# EAGLE schematic lt mikro workshop buckup (EAGLE 7.6.0)

## Sheet 1 of 2
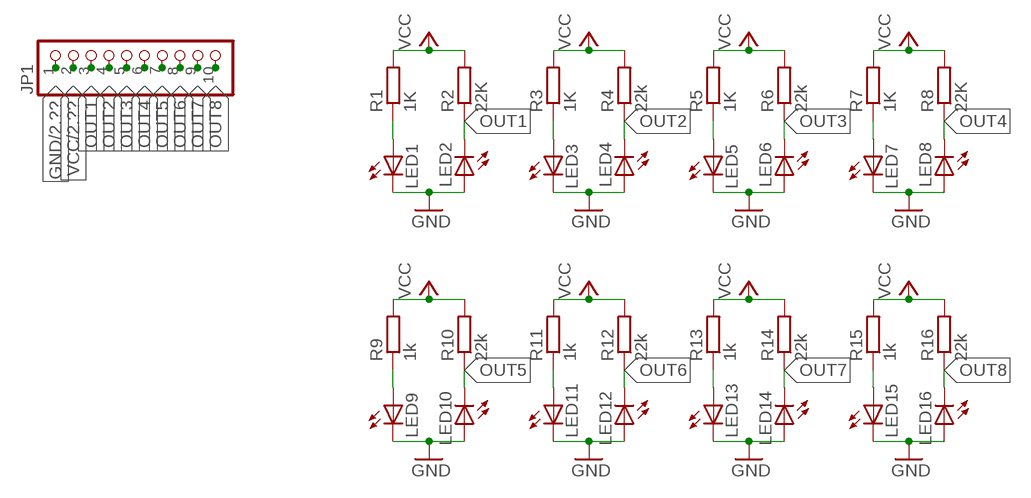
[diagram p0: schematic, sheet 1]

### Parts
JP1  PINHD-1X10  [1X10]
LED1  LED3MM  [LED3MM]
LED2  LED3MM  [LED3MM]
LED3  LED3MM  [LED3MM]
LED4  LED3MM  [LED3MM]
LED5  LED3MM  [LED3MM]
LED6  LED3MM  [LED3MM]
LED7  LED3MM  [LED3MM]
LED8  LED3MM  [LED3MM]
LED9  LED3MM  [LED3MM]
LED10  LED3MM  [LED3MM]
LED11  LED3MM  [LED3MM]
LED12  LED3MM  [LED3MM]
LED13  LED3MM  [LED3MM]
LED14  LED3MM  [LED3MM]
LED15  LED3MM  [LED3MM]
LED16  LED3MM  [LED3MM]
R1  1K  R-EU_0204/7  [0204/7]
R2  22K  R-EU_0204/7  [0204/7]
R3  1K  R-EU_0204/7  [0204/7]
R4  22k  R-EU_0204/7  [0204/7]
R5  1K  R-EU_0204/7  [0204/7]
R6  22k  R-EU_0204/7  [0204/7]
R7  1K  R-EU_0204/7  [0204/7]
R8  22K  R-EU_0204/7  [0204/7]
R9  1k  R-EU_0204/7  [0204/7]
R10  22k  R-EU_0204/7  [0204/7]
R11  1k  R-EU_0204/7  [0204/7]
R12  22k  R-EU_0204/7  [0204/7]
R13  1k  R-EU_0204/7  [0204/7]
R14  22k  R-EU_0204/7  [0204/7]
R15  1k  R-EU_0204/7  [0204/7]
R16  22k  R-EU_0204/7  [0204/7]

### Nets
GND: JP1.1 LED1.K(C) LED2.A LED3.K(C) LED4.A LED5.K(C) LED6.A LED7.K(C) LED8.A LED9.K(C) LED10.A LED11.K(C) LED12.A LED13.K(C) LED14.A LED15.K(C) LED16.A ; also sheet 2
N$1: LED3.A R3.1
N$2: LED1.A R1.1
N$3: LED5.A R5.1
N$4: LED7.A R7.1
N$5: LED9.A R9.1
N$6: LED11.A R11.1
N$7: LED13.A R13.1
N$8: LED15.A R15.1
OUT1: JP1.3 LED2.K(C) R2.1
OUT2: JP1.4 LED4.K(C) R4.1
OUT3: JP1.5 LED6.K(C) R6.1
OUT4: JP1.6 LED8.K(C) R8.1
OUT5: JP1.7 LED10.K(C) R10.1
OUT6: JP1.8 LED12.K(C) R12.1
OUT7: JP1.9 LED14.K(C) R14.1
OUT8: JP1.10 LED16.K(C) R16.1
VCC: JP1.2 R1.2 R2.2 R3.2 R4.2 R5.2 R6.2 R7.2 R8.2 R9.2 R10.2 R11.2 R12.2 R13.2 R14.2 R15.2 R16.2 ; also sheet 2

## Sheet 2 of 2
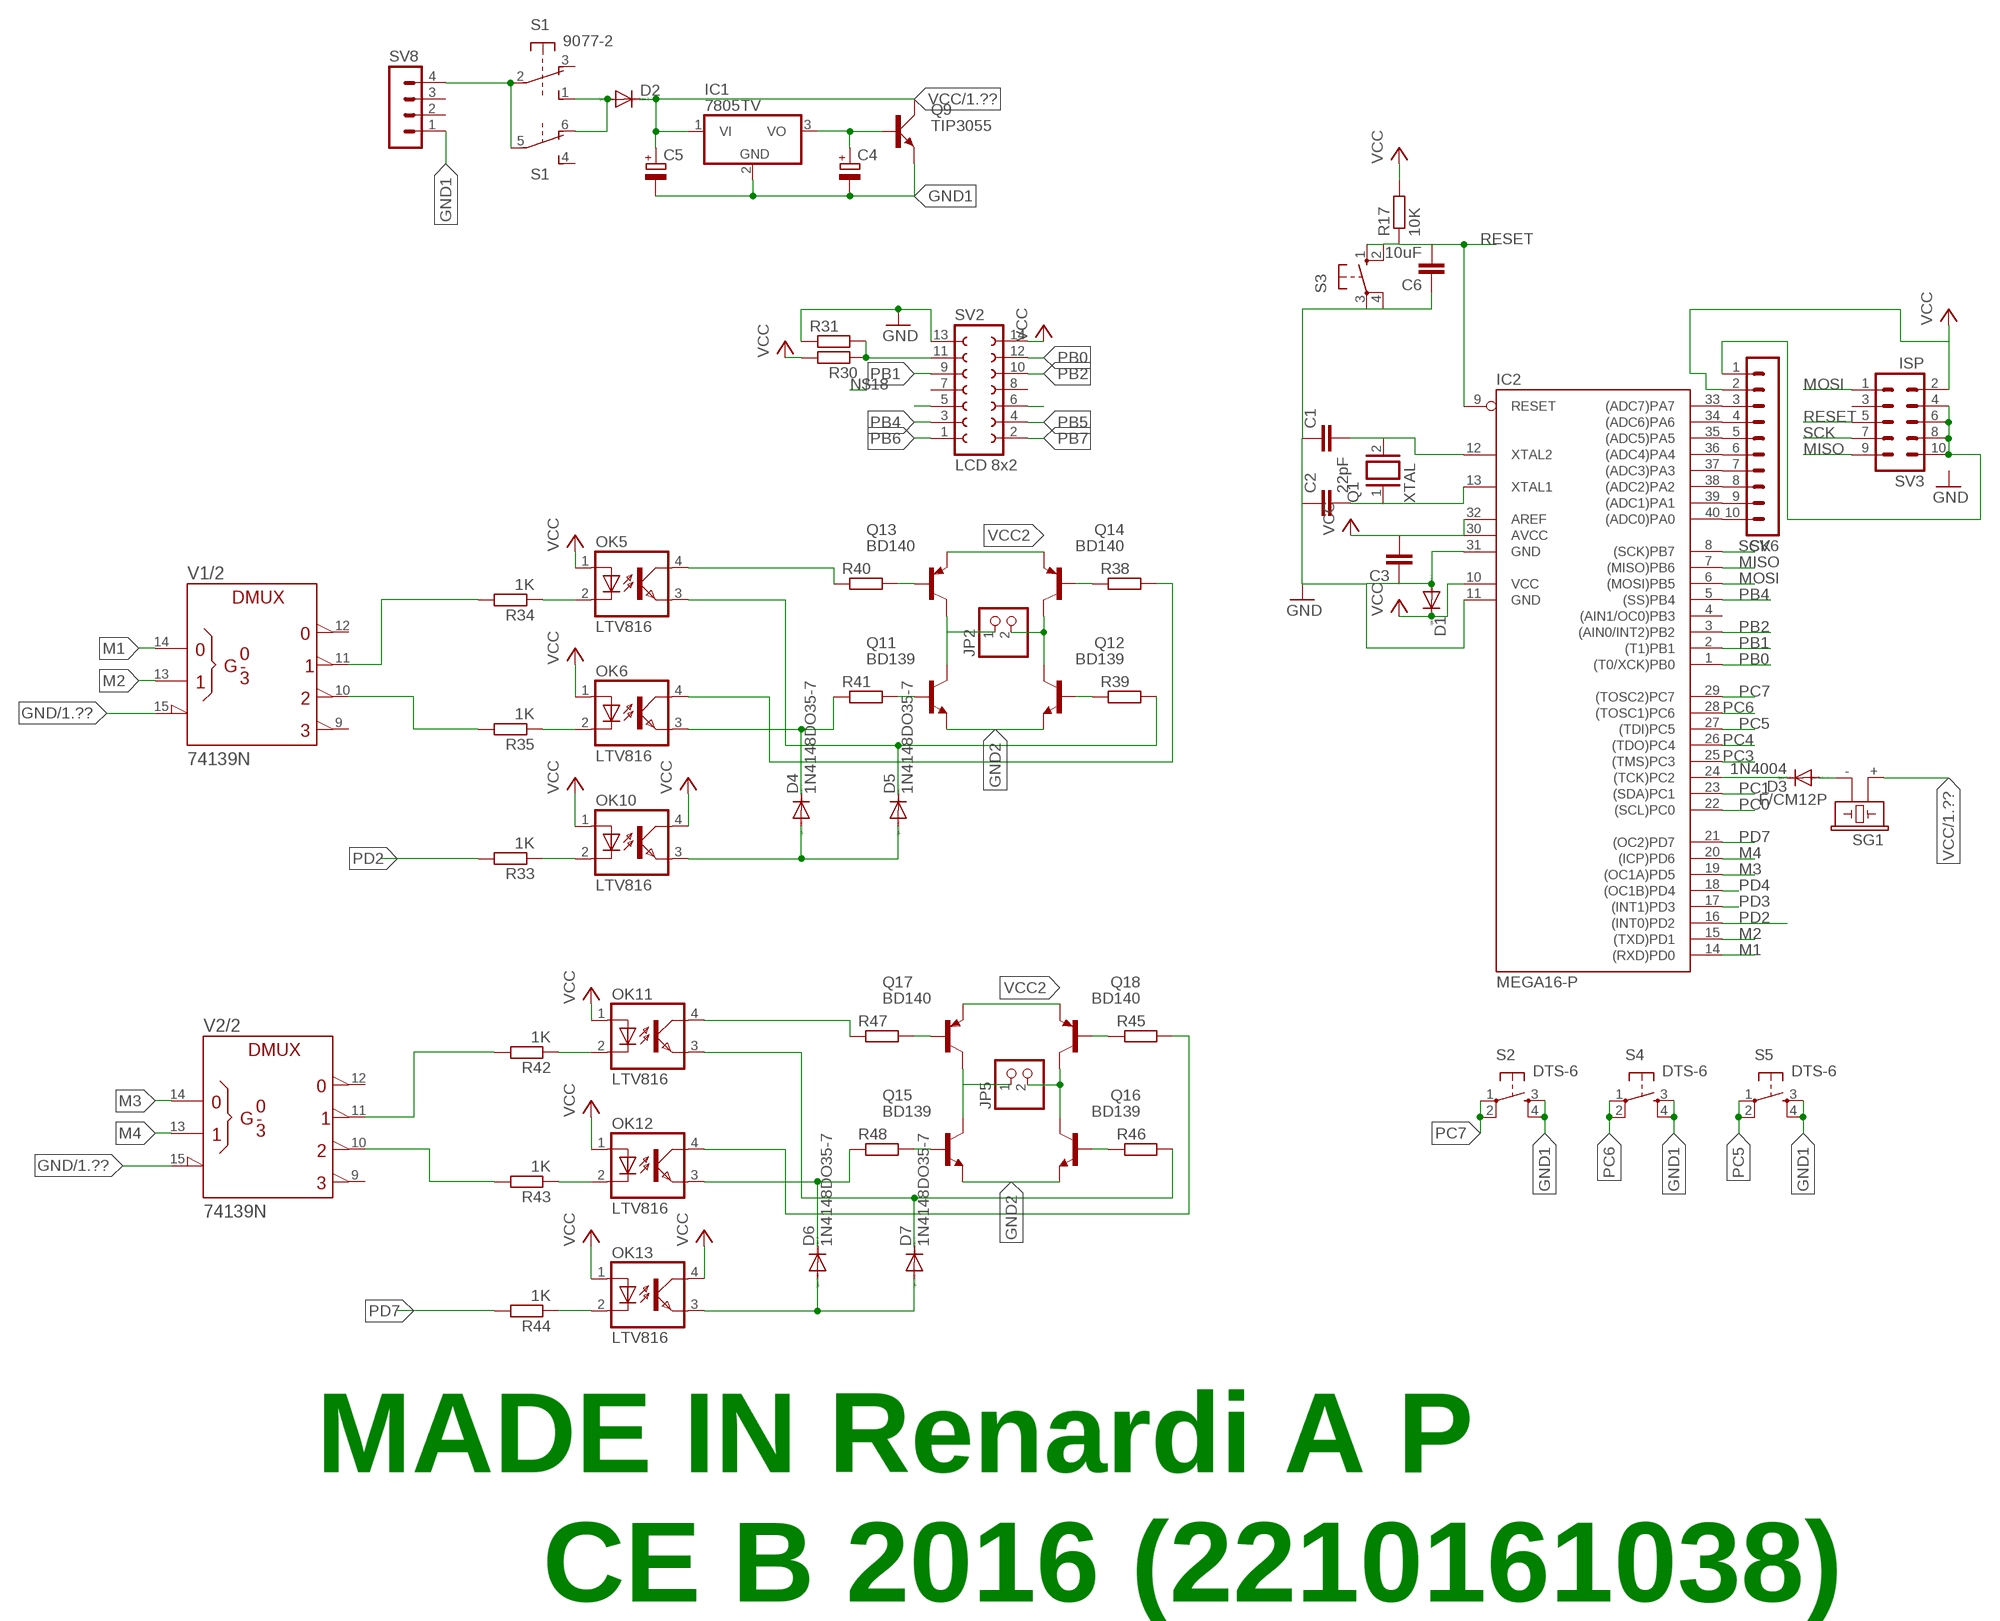
[diagram p1: schematic, sheet 2]

### Parts
C1  C2.5/2  [C2.5-2]
C2  22pF  C2.5/2  [C2.5-2]
C3  C2.5/2  [C2.5-2]
C4  CPOL-EUE7.5-18  [E7,5-18]
C5  CPOL-EUE7.5-18  [E7,5-18]
C6  10uF  C2.5/2  [C2.5-2]
D1  DIODE-D-5  [D-5]
D2  DIODE-DO214AA  [DO214AA]
D3  1N4004  [DO41-10]
D4  1N4148DO35-7  [DO35-7]
D5  1N4148DO35-7  [DO35-7]
D6  1N4148DO35-7  [DO35-7]
D7  1N4148DO35-7  [DO35-7]
IC1  7805TV  [TO220V]
IC2  MEGA16-P  [DIL40]
JP2  PINHD-1X2  [1X02]
JP5  PINHD-1X2  [1X02]
OK5  LTV816  [DIL04]
OK6  LTV816  [DIL04]
OK10  LTV816  [DIL04]
OK11  LTV816  [DIL04]
OK12  LTV816  [DIL04]
OK13  LTV816  [DIL04]
Q1  XTAL  XTAL/S  [QS]
Q9  TIP3055  [TOP3AV]
Q11  BD139  [TO126]
Q12  BD139  [TO126]
Q13  BD140  [TO126]
Q14  BD140  [TO126]
Q15  BD139  [TO126]
Q16  BD139  [TO126]
Q17  BD140  [TO126]
Q18  BD140  [TO126]
R17  10K  R-EU_0204/7  [0204/7]
R30  R-EU_0207/7  [0207/7]
R31  R-EU_0207/7  [0207/7]
R33  1K  R-EU_0204/7  [0204/7]
R34  1K  R-EU_0204/7  [0204/7]
R35  1K  R-EU_0204/7  [0204/7]
R38  R-EU_0207/7  [0207/7]
R39  R-EU_0207/7  [0207/7]
R40  R-EU_0207/7  [0207/7]
R41  R-EU_0207/7  [0207/7]
R42  1K  R-EU_0204/7  [0204/7]
R43  1K  R-EU_0204/7  [0204/7]
R44  1K  R-EU_0204/7  [0204/7]
R45  R-EU_0207/7  [0207/7]
R46  R-EU_0207/7  [0207/7]
R47  R-EU_0207/7  [0207/7]
R48  R-EU_0207/7  [0207/7]
S1  9077-2  [9077-2]
S2  DTS-6  [DTS-6]
S3  10-XX  [B3F-10XX]
S4  DTS-6  [DTS-6]
S5  DTS-6  [DTS-6]
SG1  F/CM12P  [F/CM12P]
SV2  LCD 8x2  FE07-2  [FE07-2]
SV3  ISP  MA05-2  [MA05-2]
SV6  MA10-1  [MA10-1]
SV8  MA04-1  [MA04-1]
V1  74139N  [DIL16]
V2  74139N  [DIL16]

### Nets
GND: R31.1 SV2.13 V1.15(/2:!G) V2.15(/2:!G) ; also sheet 1
GND1: C4.- C5.- IC1.2(GND) Q9.E S2.3 S2.4 S4.3 S4.4 S5.3 S5.4 SV8.1
GND2: Q11.1(E) Q12.1(E) Q15.1(E) Q16.1(E)
M1: IC2.14((RXD)PD0) V1.14(/2:A)
M2: IC2.15((TXD)PD1) V1.13(/2:B)
M3: IC2.19((OC1A)PD5) V2.14(/2:A)
M4: IC2.20((ICP)PD6) V2.13(/2:B)
MISO: IC2.7((MISO)PB6) SV3.9
MOSI: IC2.6((MOSI)PB5) SV3.1
N$9: C2.2 IC2.13(XTAL1) Q1.1
N$10: C1.2 IC2.12(XTAL2) Q1.2
N$11: D2.A S1.1(1:S) S1.6(2:O)
N$12: R30.1 R31.2 SV2.11
N$14: OK10.2(C) R33.1
N$17: OK5.2(C) R34.1
N$18: OK6.2(C) R35.1
N$19: C4.+ IC1.3(VO) Q9.B
N$20: SV2.5
N$21: JP2.1 Q11.2(C) Q13.2(C)
N$22: S1.2(1:P) S1.5(2:P) SV8.4
N$23: SV2.6
N$24: JP2.2 Q12.2(C) Q14.2(C)
N$25: Q13.3(B) R40.2
N$26: Q14.3(B) R38.1
N$27: Q12.3(B) R39.1
N$28: C1.1 C2.1 C3.1 C6.1 D1.A IC2.11(GND) IC2.31(GND) S3.3(P) S3.4(P1) SV3.4 SV3.6 SV3.8 SV3.10 SV6.1 ; supply symbol labelled GND
N$48: R35.2 V1.10(/2:Y2)
N$49: R34.2 V1.11(/2:Y1)
N$50: Q11.3(B) R41.2
N$51: D3.C IC2.24((TCK)PC2)
N$52: IC2.40((ADC0)PA0) SV6.10
N$53: IC2.33((ADC7)PA7) SV6.3
N$54: IC2.34((ADC6)PA6) SV6.4
N$55: IC2.35((ADC5)PA5) SV6.5
N$56: IC2.36((ADC4)PA4) SV6.6
N$57: IC2.37((ADC3)PA3) SV6.7
N$58: D3.A SG1.-
N$59: OK5.4(COL) R40.1
N$60: IC2.38((ADC2)PA2) SV6.8
N$61: IC2.39((ADC1)PA1) SV6.9
N$62: D5.C OK5.3(EMIT) R39.2
N$63: OK6.4(COL) R38.2
N$64: D4.C OK6.3(EMIT) R41.1
N$65: D4.A D5.A OK10.3(EMIT)
N$66: OK12.2(C) R43.1
N$67: OK11.2(C) R42.1
N$68: OK13.2(C) R44.1
N$70: R43.2 V2.10(/2:Y2)
N$71: R42.2 V2.11(/2:Y1)
N$72: JP5.1 Q15.2(C) Q17.2(C)
N$73: JP5.2 Q16.2(C) Q18.2(C)
N$74: Q17.3(B) R47.2
N$75: Q18.3(B) R45.1
N$76: Q16.3(B) R46.1
N$77: Q15.3(B) R48.2
N$78: OK11.4(COL) R47.1
N$79: D7.C OK11.3(EMIT) R46.2
N$80: OK12.4(COL) R45.2
N$81: D6.C OK12.3(EMIT) R48.1
N$82: D6.A D7.A OK13.3(EMIT)
PB0: IC2.1((T0/XCK)PB0) SV2.12
PB1: IC2.2((T1)PB1) SV2.9
PB2: IC2.3((AIN0/INT2)PB2) SV2.10
PB4: IC2.5((SS)PB4) SV2.3
PB5: SV2.4
PB6: SV2.1
PB7: SV2.2
PC0: IC2.22((SCL)PC0)
PC1: IC2.23((SDA)PC1)
PC3: IC2.25((TMS)PC3)
PC4: IC2.26((TDO)PC4)
PC5: IC2.27((TDI)PC5) S5.1 S5.2
PC6: IC2.28((TOSC1)PC6) S4.1 S4.2
PC7: IC2.29((TOSC2)PC7) S2.1 S2.2
PD2: IC2.16((INT0)PD2) R33.2
PD3: IC2.17((INT1)PD3)
PD4: IC2.18((OC1B)PD4)
PD7: IC2.21((OC2)PD7) R44.2
RESET: C6.2 IC2.9(RESET) R17.1 S3.1(S) S3.2(S1) SV3.5
SCK: IC2.8((SCK)PB7) SV3.7
VCC: C3.2 C5.+ D1.C D2.C IC1.1(VI) IC2.10(VCC) IC2.30(AVCC) IC2.32(AREF) OK5.1(A) OK6.1(A) OK10.1(A) OK10.4(COL) OK11.1(A) OK12.1(A) OK13.1(A) OK13.4(COL) Q9.C R17.2 R30.2 SG1.+ SV2.14 SV3.2 SV6.2 ; also sheet 1
VCC2: Q13.1(E) Q14.1(E) Q17.1(E) Q18.1(E)
Unconnected: IC2.4((AIN1/OC0)PB3) S1.3(1:O) S1.4(2:S) SV2.7 SV2.8 SV3.3 SV8.2 SV8.3 V1.1(/1:!G) V1.2(/1:A) V1.3(/1:B) V1.4(/1:Y0) V1.5(/1:Y1) V1.6(/1:Y2) V1.7(/1:Y3) V1.9(/2:Y3) V1.12(/2:Y0) V2.1(/1:!G) V2.2(/1:A) V2.3(/1:B) V2.4(/1:Y0) V2.5(/1:Y1) V2.6(/1:Y2) V2.7(/1:Y3) V2.9(/2:Y3) V2.12(/2:Y0)

### Notes on the sheet
- MADE IN Renardi A P
- CE B 2016 (2210161038)

## Power pins joined to a net without a drawn wire
+UB: V1.16(/+UB:+UB) V2.16(/+UB:+UB)
-UB: V1.8(/-UB:-UB) V2.8(/-UB:-UB)

## Library data of the parts
C1-C3 C6 = capacitor-wima:C: CAPACITOR naming: grid - package width
C4 C5 = rcl:CPOL-EU: POLARIZED CAPACITOR, European symbol
D1 D2 = diode:DIODE-: DIODE
D3 = diode:1N4004: DIODE general purpose rectifier, 1 A
D4-D7 = diode:1N4148: DIODE high speed (Philips)
IC1 = linear:78*: Positive VOLTAGE REGULATOR Source: http://cache.national.com/ds/LM/LM78L05.pdf http://www.fairchildsemi.com/ds/LM/LM7805.pdf
IC2 = atmel:MEGA16-P: MICROCONTROLLER 16 Kbytes FLASH 1 kbytes SRAM 512 bytes EEPROM USART 8-channel 10 bit ADC Source: avr.lbr
JP1 = pinhead:PINHD-1X10: PIN HEADER
JP2 JP5 = pinhead:PINHD-1X2: PIN HEADER
LED1-LED16 = led:LED: LED OSRAM: - CHIPLED LG R971, LG N971, LY N971, LG Q971, LY Q971, LO R971, LY R971 LH N974, LH R974 LS Q976, LO Q976, LY Q976 LO Q996 - Hyper CHIPLED LW Q18S LB Q993, LB Q99A, LB R99A - SideLED LS A670, LO A670, LY A670, LG A670, LP A670 LB A673, LV A673, LT A673, LW A673 LH A674 LY A675 LS A676, LA A676, LO A676, LY A676, LW A676 LS A679, LY A679, LG A679 - Hyper Micro SIDELED® LS Y876, LA Y876, LO Y876, LY Y876 LT Y87S - SmartLED LW L88C, LW L88S LB L89C, LB L89S, LG L890 LS L89K, LO L89K, LY L89K LS L896, LA L896, LO L896, LY L896 - TOPLED LS T670, LO T670, LY T670, LG T670, LP T670 LSG T670, LSP T670, LSY T670, LOP T670, LYG T670 LG T671, LOG T671, LSG T671 LB T673, LV T673, LT T673, LW T673 LH T674 LS T676, LA T676, LO T676, LY T676, LB T676, LH T676, LSB T676, LW T676 LB T67C, LV T67C, LT T67C, LS T67K, LO T67K, LY T67K, LW E67C LS E67B, LA E67B, LO E67B, LY E67B, LB E67C, LV E67C, LT E67C LW T67C LS T679, LY T679, LG T679 LS T770, LO T770, LY T770, LG T770, LP T770 LB T773, LV T773, LT T773, LW T773 LH T774 LS E675, LA E675, LY E675, LS T675 LS T776, LA T776, LO T776, LY T776, LB T776 LHGB T686 LT T68C, LB T68C - Hyper Mini TOPLED® LB M676 - Mini TOPLED Santana® LG M470 LS M47K, LO M47K, LY M47K Source: http://www.osram.convergy.de LUXEON: - LUMILED® LXK2-PW12-R00, LXK2-PW12-S00, LXK2-PW14-U00, LXK2-PW14-V00 LXK2-PM12-R00, LXK2-PM12-S00, LXK2-PM14-U00 LXK2-PE12-Q00, LXK2-PE12-R00, LXK2-PE12-S00, LXK2-PE14-T00, LXK2-PE14-U00 LXK2-PB12-K00, LXK2-PB12-L00, LXK2-PB12-M00, LXK2-PB14-N00, LXK2-PB14-P00, LXK2-PB14-Q00 LXK2-PR12-L00, LXK2-PR12-M00, LXK2-PR14-Q00, LXK2-PR14-R00 LXK2-PD12-Q00, LXK2-PD12-R00, LXK2-PD12-S00 LXK2-PH12-R00, LXK2-PH12-S00 LXK2-PL12-P00, LXK2-PL12-Q00, LXK2-PL12-R00 Source: www.luxeon.com KINGBRIGHT: KA-3528ASYC Source: www.kingbright.com
OK5 OK6 OK10-OK13 = optocoupler:LTV816: OPTO COUPLER Source: LITEON, LTV816.pdf
Q1 = special:XTAL/S: CRYSTAL
Q9 = transistor-power:TIP3055: NPN TRANSISTOR
Q11 Q12 Q15 Q16 = transistor-npn:BD139*: NPN Transistor
Q13 Q14 Q17 Q18 = transistor-pnp:BD140: PNP Transistor
R1-R17 R30 R31 R33-R35 R38-R48 = resistor:R-EU_: RESISTOR, European symbol
S1 = switch-misc:9077-2: MARQUARDT SWITCH 9077.0200 Distributor: Buerklin <https://www.buerklin.com/default.asp?event=ShowArtikel%2812G2822%29&l=d&jump=ArtNr_12G2822>
S2 S4 S5 = switch-tact:DTS-6
S3 = switch-omron:10-XX: OMRON SWITCH
SG1 = buzzer:F/CM12P: BUZZER Source: Buerklin
SV2 = con-lsta:FE07-2: FEMALE HEADER
SV3 = con-lstb:MA05-2: PIN HEADER
SV6 = con-lstb:MA10-1: PIN HEADER
SV8 = con-lstb:MA04-1: PIN HEADER; OC_FARNELL: unknown; OC_NEWARK: unknown
V1 V2 = 74ttl-din:74*139: Dual 2-line to 4-line DECODER/DEMULTIPLEXER